# EAGLE schematic ignitors (EAGLE 6.4)
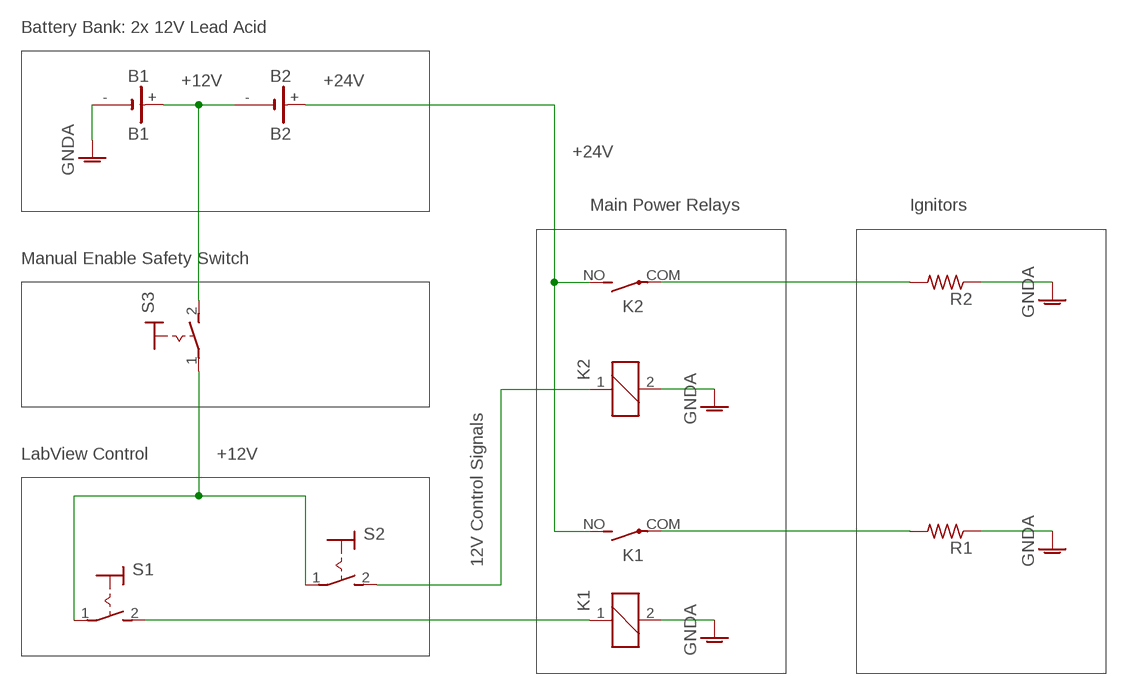
[diagram p0: schematic, sheet 1]

## Parts
B1  B1  SL-160AA/PT  [SL-160AA/PT]
B2  B2  SL-160AA/PT  [SL-160AA/PT]
K1  APF30212A  [APF30212A]
K2  APF30212A  [APF30212A]
R1  R-US_0204/2V  [0204V]
R2  R-US_0204/2V  [0204V]
S1  MS243  [MS243]
S2  MS243  [MS243]
S3  MS243  [MS243]

## Nets
GNDA: B1.- K1.2 K2.2 R1.1 R2.1
N$1: S1.1(P) S2.1(P) S3.1(P)
N$2: K1.1 S1.2(S)
N$3: B2.+ K1.NO(2:S) K2.NO(2:S)
N$5: K1.COM(2:P) R1.2
N$6: K2.COM(2:P) R2.2
N$7: B1.+ B2.- S3.2(S)
N$8: K2.1 S2.2(S)
Unconnected: B1.-@1(-) B2.-@1(-)

## Notes on the sheet
- Battery Bank: 2x 12V Lead Acid
- +12V | +24V
- +24V
- Main Power Relays | Ignitors
- Manual Enable Safety Switch
- LabView Control | +12V
- 12V Control Signals

## Library data of the parts
B1 B2 = battery:SL-160AA/PT: LI BATTERY Sonnenschein
K1 K2 = relay:APF30212A: Compliant with European standards 1a/1c 6A Slim power relays Source: Data sheet <http://pewa.panasonic.com/assets/pcsd/catalog/pf-catalog.pdf>; OC_FARNELL: unknown
R1 R2 = resistor:R-US_: RESISTOR, American symbol
S1-S3 = switch:MS243: TOGGLE SWITCH